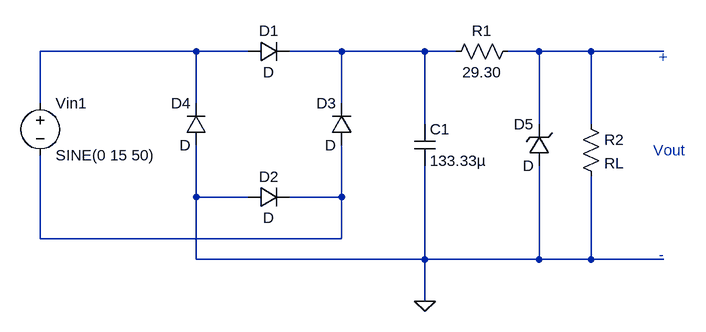
[diagram p0: schematic Voltage_Regulator.asc]
Voltage_Regulator.asc, the LTspice schematic file:
Version 4
SHEET 1 1208 680
WIRE 240 176 0 176
WIRE 320 176 240 176
WIRE 464 176 384 176
WIRE 592 176 464 176
WIRE 640 176 592 176
WIRE 768 176 720 176
WIRE 848 176 768 176
WIRE 960 176 848 176
WIRE 0 256 0 176
WIRE 240 256 240 176
WIRE 464 256 464 176
WIRE 592 288 592 176
WIRE 768 288 768 176
WIRE 848 288 848 176
WIRE 240 400 240 320
WIRE 320 400 240 400
WIRE 464 400 464 320
WIRE 464 400 384 400
WIRE 0 464 0 336
WIRE 464 464 464 400
WIRE 464 464 0 464
WIRE 240 496 240 400
WIRE 592 496 592 352
WIRE 592 496 240 496
WIRE 768 496 768 352
WIRE 768 496 592 496
WIRE 848 496 848 368
WIRE 848 496 768 496
WIRE 960 496 848 496
WIRE 592 560 592 496
FLAG 592 560 0
SYMBOL diode 320 192 R270
WINDOW 0 32 32 VTop 2
WINDOW 3 0 32 VBottom 2
SYMATTR InstName D1
SYMBOL diode 320 416 R270
WINDOW 0 32 32 VTop 2
WINDOW 3 0 32 VBottom 2
SYMATTR InstName D2
SYMBOL diode 480 320 R180
WINDOW 0 24 64 Left 2
WINDOW 3 24 0 Left 2
SYMATTR InstName D3
SYMBOL diode 256 320 R180
WINDOW 0 24 64 Left 2
WINDOW 3 24 0 Left 2
SYMATTR InstName D4
SYMBOL voltage 0 240 R0
SYMATTR InstName Vin1
SYMATTR Value SINE(0 15 50)
SYMBOL cap 576 288 R0
SYMATTR InstName C1
SYMATTR Value 133.33µ
SYMBOL zener 784 352 R180
WINDOW 0 24 64 Left 2
WINDOW 3 24 0 Left 2
SYMATTR InstName D5
SYMBOL res 736 160 R90
WINDOW 0 0 56 VBottom 2
WINDOW 3 32 56 VTop 2
SYMATTR InstName R1
SYMATTR Value 29.30
SYMBOL res 832 272 R0
SYMATTR InstName R2
SYMATTR Value RL
TEXT 944 328 Left 2 ;Vout
TEXT 952 184 Left 2 ;+
TEXT 952 488 Left 2 ;-

The netlist it stands for:
* Voltage_Regulator.asc
D1 N001 N002 D
D2 0 N004 D
D3 N004 N002 D
D4 0 N001 D
Vin1 N001 N004 SINE(0 15 50)
C1 N002 0 133.33µ
D5 0 N003 D
R1 N003 N002 29.30
R2 N003 0 RL
.model D D
.lib standard.dio
* Vout
* +
* -
.backanno
.end